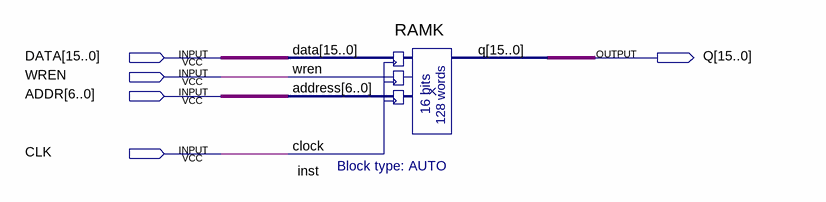
[diagram p0: schematic sheet]
// Quartus schematic RAM_T.bdf as structural Verilog: 1 symbols, 5 pins
module RAM_T (
  input  [15:0] DATA,
  input  WREN,
  input  [6:0] ADDR,
  input  CLK,
  output [15:0] Q
);

  RAMK inst (.data(DATA), .wren(WREN), .address(ADDR), .clock(CLK), .q(Q));
endmodule
